# Altium schematic sheet GPS.SchDoc
size A4
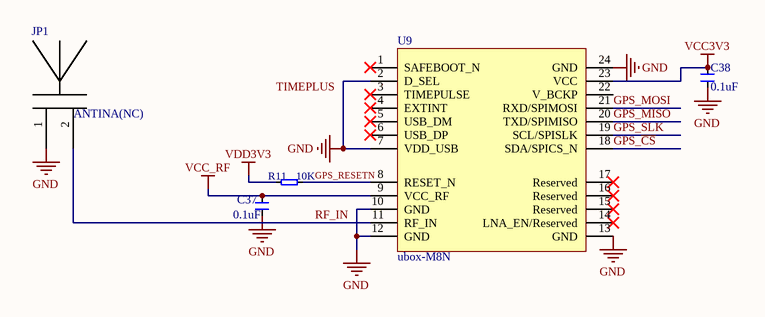
[diagram p0: GPS.SchDoc]

## Parts
C37  0.1uF  [0603C]
C38  0.1uF  [0603C]
JP1  ANTINA(NC)  [IPEX-20279-00E-03]
R11  10K  [0603R]
U9  ubox-M8N  [ublox-M8]

## Nets
GND: C37.2 C38.1 JP1.1 U9.2(D_SEL) U9.7(VDD_USB) U9.10(GND) U9.12(GND) U9.13(GND) U9.24(GND)
VCC3V3: C38.2 U9.23(VCC)
VCC_RF: C37.1 U9.9(VCC_RF)
VDD3V3: R11.1
GPS_~{CS}: U9.18(SDA/SPICS_N)
GPS_MISO: U9.20(TXD/SPIMISO)
GPS_MOSI: U9.21(RXD/SPIMOSI)
GPS_RESETN: R11.2 U9.8(RESET_N)
GPS_SLK: U9.19(SCL/SPISLK)
RF_IN: JP1.2 U9.11(RF_IN)

Not connected (* = marked no-connect by the designer): U9 1(SAFEBOOT_N)* 3(TIMEPULSE)* 4(EXTINT)* 5(USB_DM)* 6(USB_DP)* 14(LNA_EN/Reserved)* 15(Reserved)* 16(Reserved)* 17(Reserved)* 22(V_BCKP)

## Notes on the sheet
- Labels drawn without touching a wire or pin: TIMEPLUS

## Library data of the parts
C37 C38 = C
JP1 = ANTINA
R11 = R